# EAGLE design SOP-8_3 PCB (EAGLE 9.6.2)
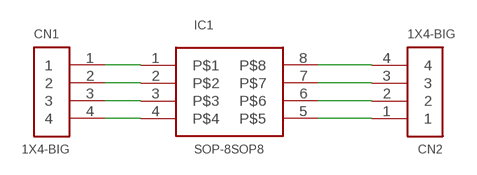
[diagram p0: schematic, sheet 1]

## Parts
CN1  1X4-BIG  [1X04-BIG]
CN2  1X4-BIG  [1X04-BIG]
IC1  SOP-8SOP8  [SOP-8]

## Nets
N$1: CN1.1 IC1.1
N$2: CN1.2 IC1.2
N$3: CN1.3 IC1.3
N$4: CN1.4 IC1.4
N$5: CN2.4 IC1.8
N$6: CN2.3 IC1.7
N$7: CN2.2 IC1.6
N$8: CN2.1 IC1.5

## Library data of the parts
CN1 CN2 = adafruit:1X4: 4-pin connector
IC1 = SOP-8:SOP-8: SOP-8; AVAILABILITY: In Stock; DESCRIPTION: EEPROM Memory IC 2Kb (256 x 8) I²C 1MHz 550ns 8-Mini Map (2x3); MF: Microchip; MP: AT24C02; PACKAGE: UDFN-8 Microchip; PRICE: None; PURCHASE-URL: https://pricing.snapeda.com/search/part/AT24C02/?ref=eda

## Board
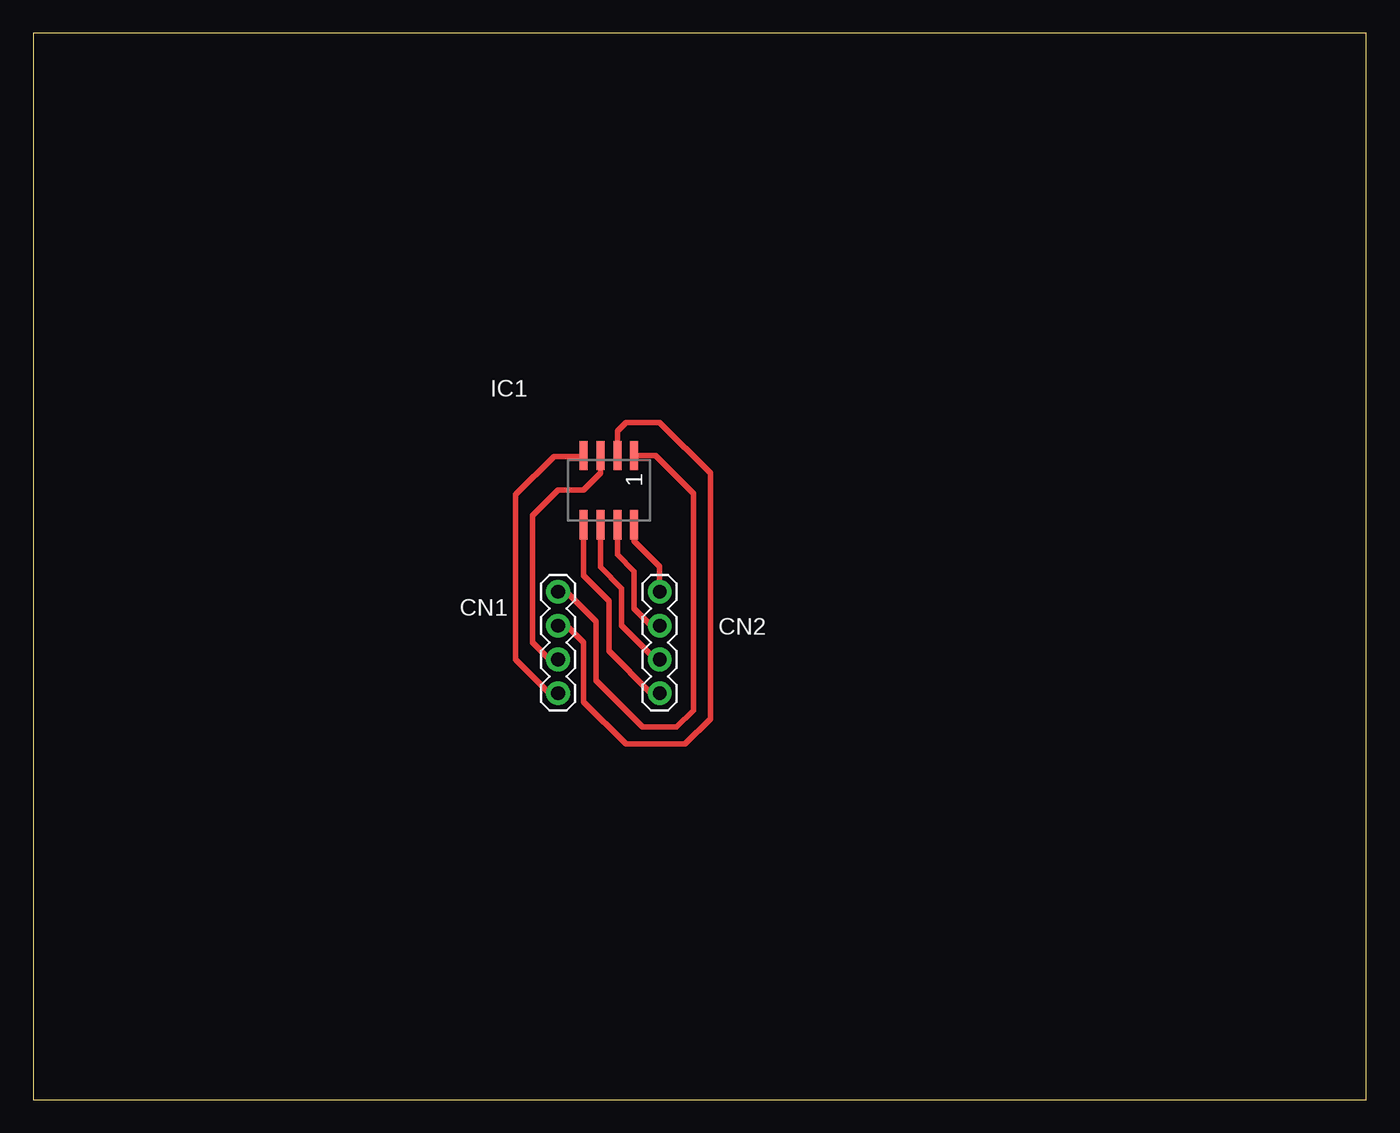
[diagram p1: board, top side]

Size 100 x 80 mm. Coordinates in mm from the lower left corner, seen from the top.
Outline: 0,0 100,0 100,80 0,80 0,0
Copper layers (1*16): Top 0.035mm / dielectric 1.5mm / Bottom 0.035mm
Design rules "default": minimum track width 6mil, minimum drill 0.35mm, track to track 6mil, track to pad 6mil, pad to pad 6mil, via to via 6mil, smd to smd 6mil, copper to edge 40mil, drill to drill 6mil, minimum pad ring 10mil, minimum via ring 8mil, stop-mask expansion 4mil, vias tented up to drill 0mil, thermal gap 10mil

### Footprints (pad centres in the part's own frame; a part is rotated, then mirrored left to right if it is on the bottom)
1X04-BIG = drill 1.016 pad 1.778: 1 0,0; 2 2.54,0; 3 5.08,0; 4 7.62,0
SOP-8 = smd 0.6 x 2.2: 1 -1.905,-2.6; 2 -0.635,-2.6; 3 0.635,-2.6; 4 1.905,-2.6; 5 1.905,2.6; 6 0.635,2.6; 7 -0.635,2.6; 8 -1.905,2.6

### Placement (x,y rotation side)
CN1  39.37,38.1 270 top
CN2  46.99,30.48 90 top
IC1  43.18,45.72 180 top

### Tracks (layer width: path | path; a pad name or v marks a point on that pad's centre or on a via)
N$1
  Top 0.152: 40.01,38.1 CN1.1
  Top 0.406: IC1.1 46.67,48.32 49.53,45.46 49.53,29.21 48.26,27.94 45.72,27.94 42.23,31.43 42.23,35.88 40.01,38.1
N$2
  Top 0.406: IC1.2 43.81,50.16 44.45,50.8 46.99,50.8 50.8,46.99 50.8,28.57 48.9,26.67 44.45,26.67 41.27,29.84 41.27,34.29 40.01,35.56 CN1.2
N$3
  Top 0.406: IC1.3 42.55,46.99 41.27,45.72 39.37,45.72 37.47,43.81 37.47,34.29 38.73,33.02 CN1.3
N$4
  Top 0.152: IC1.4 41.22,48.26
  Top 0.406: 41.22,48.26 39.05,48.26 36.2,45.4 36.2,33.02 38.73,30.48 CN1.4
N$5
  Top 0.406: IC1.8 45.09,41.91 46.99,40.01 CN2.4
N$6
  Top 0.406: IC1.7 43.81,40.9 45.09,39.63 45.09,36.83 46.35,35.56 CN2.3
N$7
  Top 0.152: 46.67,33.02 CN2.2
  Top 0.406: IC1.6 42.55,39.95 44.13,38.36 44.13,35.56 46.67,33.02
N$8
  Top 0.406: IC1.5 41.27,39.31 43.18,37.41 43.18,33.66 46.35,30.48 CN2.1